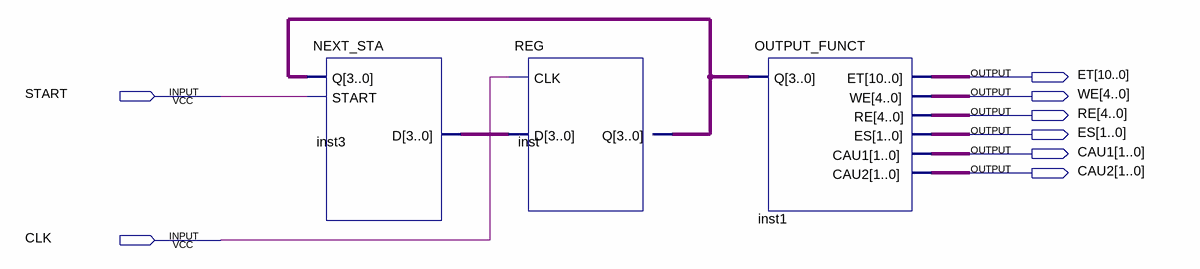
[diagram p0: schematic sheet]
// Quartus schematic CONTROLLER.bdf as structural Verilog: 3 symbols, 8 pins
module CONTROLLER (
  input  START,
  input  CLK,
  output [10:0] ET,
  output [4:0] WE,
  output [4:0] RE,
  output [1:0] ES,
  output [1:0] CAU1,
  output [1:0] CAU2
);

  wire [3:0] inst3_d, inst_q;

  NEXT_STA inst3 (.Q(inst_q), .START(START), .D(inst3_d));
  REG inst (.CLK(CLK), .D(inst3_d), .Q(inst_q));
  OUTPUT_FUNCT inst1 (.Q(inst_q), .ET(ET), .WE(WE), .RE(RE), .ES(ES), .CAU1(CAU1), .CAU2(CAU2));
endmodule
